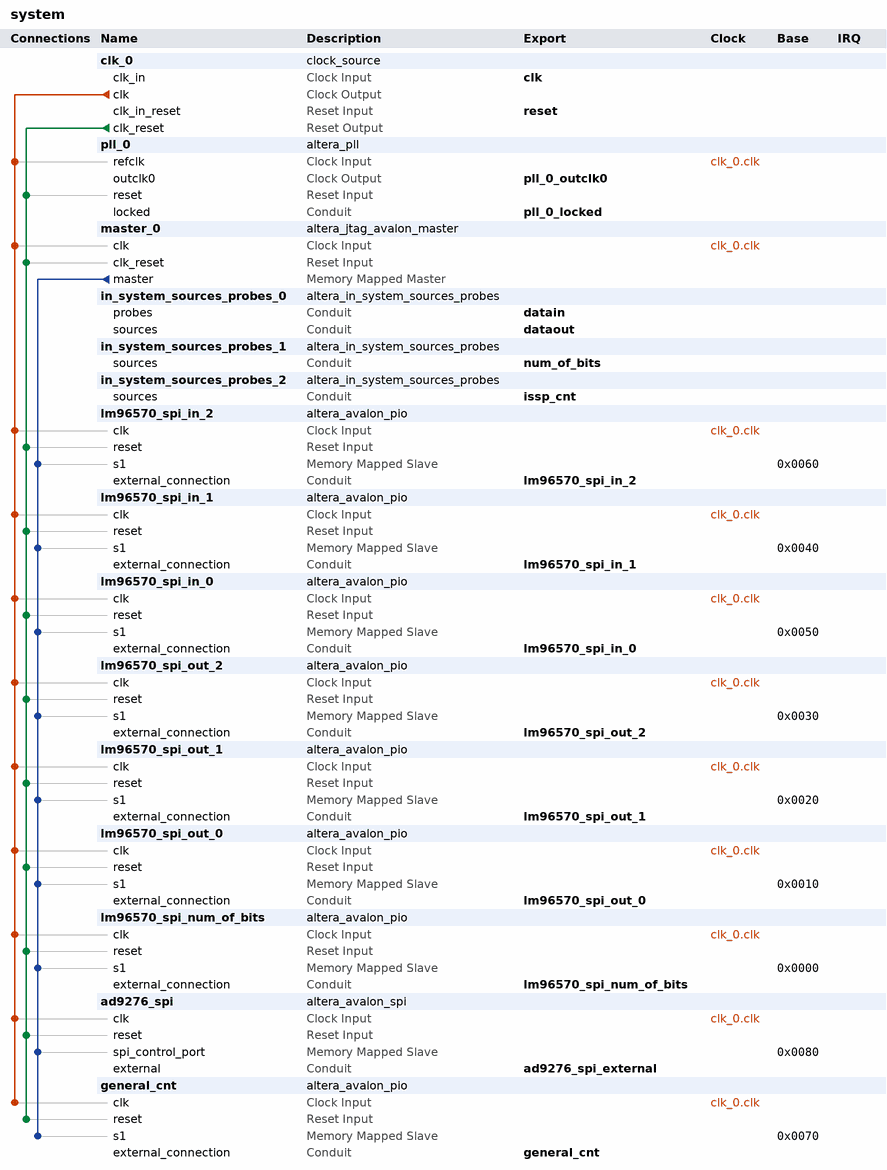
[diagram p0: system contents]
# Platform Designer (Qsys) system system, Cyclone V 5CSXFC6D6F31C6
# Parameters at their usual value, and those the tool derives, are not listed.
package require -exact qsys 17.0
create_system system
set_project_property DEVICE_FAMILY {Cyclone V}
set_project_property DEVICE 5CSXFC6D6F31C6

add_instance clk_0 clock_source 17.0
set_instance_parameter_value clk_0 clockFrequency 50000000

add_instance pll_0 altera_pll 17.0
set_instance_parameter_value pll_0 gui_device_speed_grade 2
set_instance_parameter_value pll_0 gui_number_of_clocks 1
set_instance_parameter_value pll_0 gui_operation_mode direct
set_instance_parameter_value pll_0 gui_output_clock_frequency0 2.0
set_instance_parameter_value pll_0 gui_pll_mode {Integer-N PLL}
set_instance_parameter_value pll_0 gui_reference_clock_frequency 50.0
set_instance_parameter_value pll_0 gui_use_locked true

add_instance master_0 altera_jtag_avalon_master 17.0

add_instance in_system_sources_probes_0 altera_in_system_sources_probes 17.0
set_instance_parameter_value in_system_sources_probes_0 create_source_clock false
set_instance_parameter_value in_system_sources_probes_0 instance_id NONE
set_instance_parameter_value in_system_sources_probes_0 probe_width 70
set_instance_parameter_value in_system_sources_probes_0 source_width 70

add_instance in_system_sources_probes_1 altera_in_system_sources_probes 17.0
set_instance_parameter_value in_system_sources_probes_1 create_source_clock false
set_instance_parameter_value in_system_sources_probes_1 instance_id NONE
set_instance_parameter_value in_system_sources_probes_1 probe_width 0
set_instance_parameter_value in_system_sources_probes_1 source_width 8

add_instance in_system_sources_probes_2 altera_in_system_sources_probes 17.0
set_instance_parameter_value in_system_sources_probes_2 create_source_clock false
set_instance_parameter_value in_system_sources_probes_2 instance_id NONE
set_instance_parameter_value in_system_sources_probes_2 probe_width 0
set_instance_parameter_value in_system_sources_probes_2 source_width 10

add_instance lm96570_spi_in_2 altera_avalon_pio 17.0
set_instance_parameter_value lm96570_spi_in_2 direction Output
set_instance_parameter_value lm96570_spi_in_2 width 6

add_instance lm96570_spi_in_1 altera_avalon_pio 17.0
set_instance_parameter_value lm96570_spi_in_1 direction Output
set_instance_parameter_value lm96570_spi_in_1 width 32

add_instance lm96570_spi_in_0 altera_avalon_pio 17.0
set_instance_parameter_value lm96570_spi_in_0 direction Output
set_instance_parameter_value lm96570_spi_in_0 width 32

add_instance lm96570_spi_out_2 altera_avalon_pio 17.0
set_instance_parameter_value lm96570_spi_out_2 direction Input
set_instance_parameter_value lm96570_spi_out_2 width 6

add_instance lm96570_spi_out_1 altera_avalon_pio 17.0
set_instance_parameter_value lm96570_spi_out_1 direction Input
set_instance_parameter_value lm96570_spi_out_1 width 32

add_instance lm96570_spi_out_0 altera_avalon_pio 17.0
set_instance_parameter_value lm96570_spi_out_0 direction Input
set_instance_parameter_value lm96570_spi_out_0 width 32

add_instance lm96570_spi_num_of_bits altera_avalon_pio 17.0
set_instance_parameter_value lm96570_spi_num_of_bits direction Output
set_instance_parameter_value lm96570_spi_num_of_bits width 8

add_instance ad9276_spi altera_avalon_spi 17.0
set_instance_parameter_value ad9276_spi clockPolarity 0
set_instance_parameter_value ad9276_spi dataWidth 24
set_instance_parameter_value ad9276_spi masterSPI true
set_instance_parameter_value ad9276_spi numberOfSlaves 1
set_instance_parameter_value ad9276_spi targetClockRate 4200000

add_instance general_cnt altera_avalon_pio 17.0
set_instance_parameter_value general_cnt direction Output
set_instance_parameter_value general_cnt width 32

# connections
add_connection clk_0.clk ad9276_spi.clk clock
add_connection clk_0.clk general_cnt.clk clock
add_connection clk_0.clk lm96570_spi_in_0.clk clock
add_connection clk_0.clk lm96570_spi_in_1.clk clock
add_connection clk_0.clk lm96570_spi_in_2.clk clock
add_connection clk_0.clk lm96570_spi_num_of_bits.clk clock
add_connection clk_0.clk lm96570_spi_out_0.clk clock
add_connection clk_0.clk lm96570_spi_out_1.clk clock
add_connection clk_0.clk lm96570_spi_out_2.clk clock
add_connection clk_0.clk master_0.clk clock
add_connection clk_0.clk pll_0.refclk clock
add_connection clk_0.clk_reset ad9276_spi.reset reset
add_connection clk_0.clk_reset general_cnt.reset reset
add_connection clk_0.clk_reset lm96570_spi_in_0.reset reset
add_connection clk_0.clk_reset lm96570_spi_in_1.reset reset
add_connection clk_0.clk_reset lm96570_spi_in_2.reset reset
add_connection clk_0.clk_reset lm96570_spi_num_of_bits.reset reset
add_connection clk_0.clk_reset lm96570_spi_out_0.reset reset
add_connection clk_0.clk_reset lm96570_spi_out_1.reset reset
add_connection clk_0.clk_reset lm96570_spi_out_2.reset reset
add_connection clk_0.clk_reset master_0.clk_reset reset
add_connection clk_0.clk_reset pll_0.reset reset
add_connection master_0.master ad9276_spi.spi_control_port avalon
set_connection_parameter_value master_0.master/ad9276_spi.spi_control_port baseAddress 0x0080
add_connection master_0.master general_cnt.s1 avalon
set_connection_parameter_value master_0.master/general_cnt.s1 baseAddress 0x0070
add_connection master_0.master lm96570_spi_in_0.s1 avalon
set_connection_parameter_value master_0.master/lm96570_spi_in_0.s1 baseAddress 0x0050
add_connection master_0.master lm96570_spi_in_1.s1 avalon
set_connection_parameter_value master_0.master/lm96570_spi_in_1.s1 baseAddress 0x0040
add_connection master_0.master lm96570_spi_in_2.s1 avalon
set_connection_parameter_value master_0.master/lm96570_spi_in_2.s1 baseAddress 0x0060
add_connection master_0.master lm96570_spi_num_of_bits.s1 avalon
set_connection_parameter_value master_0.master/lm96570_spi_num_of_bits.s1 baseAddress 0x0000
add_connection master_0.master lm96570_spi_out_0.s1 avalon
set_connection_parameter_value master_0.master/lm96570_spi_out_0.s1 baseAddress 0x0010
add_connection master_0.master lm96570_spi_out_1.s1 avalon
set_connection_parameter_value master_0.master/lm96570_spi_out_1.s1 baseAddress 0x0020
add_connection master_0.master lm96570_spi_out_2.s1 avalon
set_connection_parameter_value master_0.master/lm96570_spi_out_2.s1 baseAddress 0x0030

# exported interfaces
add_interface ad9276_spi_external conduit end
set_interface_property ad9276_spi_external EXPORT_OF ad9276_spi.external
add_interface clk clock sink
set_interface_property clk EXPORT_OF clk_0.clk_in
add_interface datain conduit end
set_interface_property datain EXPORT_OF in_system_sources_probes_0.probes
add_interface dataout conduit end
set_interface_property dataout EXPORT_OF in_system_sources_probes_0.sources
add_interface general_cnt conduit end
set_interface_property general_cnt EXPORT_OF general_cnt.external_connection
add_interface issp_cnt conduit end
set_interface_property issp_cnt EXPORT_OF in_system_sources_probes_2.sources
add_interface lm96570_spi_in_0 conduit end
set_interface_property lm96570_spi_in_0 EXPORT_OF lm96570_spi_in_0.external_connection
add_interface lm96570_spi_in_1 conduit end
set_interface_property lm96570_spi_in_1 EXPORT_OF lm96570_spi_in_1.external_connection
add_interface lm96570_spi_in_2 conduit end
set_interface_property lm96570_spi_in_2 EXPORT_OF lm96570_spi_in_2.external_connection
add_interface lm96570_spi_num_of_bits conduit end
set_interface_property lm96570_spi_num_of_bits EXPORT_OF lm96570_spi_num_of_bits.external_connection
add_interface lm96570_spi_out_0 conduit end
set_interface_property lm96570_spi_out_0 EXPORT_OF lm96570_spi_out_0.external_connection
add_interface lm96570_spi_out_1 conduit end
set_interface_property lm96570_spi_out_1 EXPORT_OF lm96570_spi_out_1.external_connection
add_interface lm96570_spi_out_2 conduit end
set_interface_property lm96570_spi_out_2 EXPORT_OF lm96570_spi_out_2.external_connection
add_interface num_of_bits conduit end
set_interface_property num_of_bits EXPORT_OF in_system_sources_probes_1.sources
add_interface pll_0_locked conduit end
set_interface_property pll_0_locked EXPORT_OF pll_0.locked
add_interface pll_0_outclk0 clock source
set_interface_property pll_0_outclk0 EXPORT_OF pll_0.outclk0
add_interface reset reset sink
set_interface_property reset EXPORT_OF clk_0.clk_in_reset

set_interconnect_requirement {$system} qsys_mm.clockCrossingAdapter HANDSHAKE
set_interconnect_requirement {$system} qsys_mm.enableEccProtection FALSE
set_interconnect_requirement {$system} qsys_mm.insertDefaultSlave FALSE
set_interconnect_requirement {$system} qsys_mm.maxAdditionalLatency 1

save_system system.qsys
